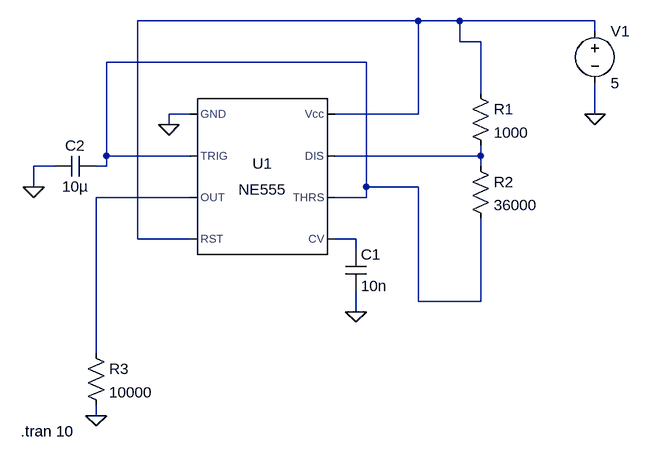
[diagram p0: schematic TSAL_flasher.asc]
TSAL_flasher.asc, the LTspice schematic file:
Version 4
SHEET 1 880 680
WIRE 352 -48 -80 -48
WIRE 416 -48 352 -48
WIRE 624 -48 416 -48
WIRE 624 -32 624 -48
WIRE 416 -16 416 -48
WIRE 448 -16 416 -16
WIRE 272 16 -128 16
WIRE 448 64 448 -16
WIRE 0 96 -32 96
WIRE 352 96 352 -48
WIRE 352 96 224 96
WIRE 624 96 624 48
WIRE -32 112 -32 96
WIRE -128 160 -128 16
WIRE 0 160 -128 160
WIRE 448 160 448 144
WIRE 448 160 224 160
WIRE -208 176 -240 176
WIRE -128 176 -128 160
WIRE -128 176 -144 176
WIRE 448 176 448 160
WIRE -240 208 -240 176
WIRE 272 208 272 16
WIRE 352 208 272 208
WIRE 0 224 -144 224
WIRE 272 224 272 208
WIRE 272 224 224 224
WIRE -80 288 -80 -48
WIRE 0 288 -80 288
WIRE 256 288 224 288
WIRE 256 304 256 288
WIRE 352 384 352 208
WIRE 448 384 448 256
WIRE 448 384 352 384
WIRE 256 400 256 368
WIRE -144 464 -144 224
WIRE -144 560 -144 544
FLAG -32 112 0
FLAG 256 400 0
FLAG -240 208 0
FLAG -144 560 0
FLAG 624 96 0
SYMBOL Misc\\NE555 112 192 R0
SYMATTR InstName U1
SYMBOL cap 240 304 R0
SYMATTR InstName C1
SYMATTR Value 10n
SYMBOL cap -144 160 R90
WINDOW 0 0 32 VBottom 2
WINDOW 3 32 32 VTop 2
SYMATTR InstName C2
SYMATTR Value 10µ
SYMBOL res 432 48 R0
SYMATTR InstName R1
SYMATTR Value 1000
SYMBOL res 432 160 R0
SYMATTR InstName R2
SYMATTR Value 36000
SYMBOL res -160 448 R0
SYMATTR InstName R3
SYMATTR Value 10000
SYMBOL voltage 624 -48 R0
WINDOW 123 0 0 Left 0
WINDOW 39 0 0 Left 0
SYMATTR InstName V1
SYMATTR Value 5
TEXT -260 584 Left 2 !.tran 10

The netlist it stands for:
* TSAL_flasher.asc
XU1 0 N002 N004 N001 N005 N002 N003 N001 NE555  ; pins GND TRIG OUT RST CV THRS DIS Vcc
C1 N005 0 10n
C2 N002 0 10µ
R1 N001 N003 1000
R2 N003 N002 36000
R3 N004 0 10000
V1 N001 0 5
.tran 10
.lib NE555.sub
.backanno
.end